# EAGLE design button configuration (EAGLE 9.3.0)
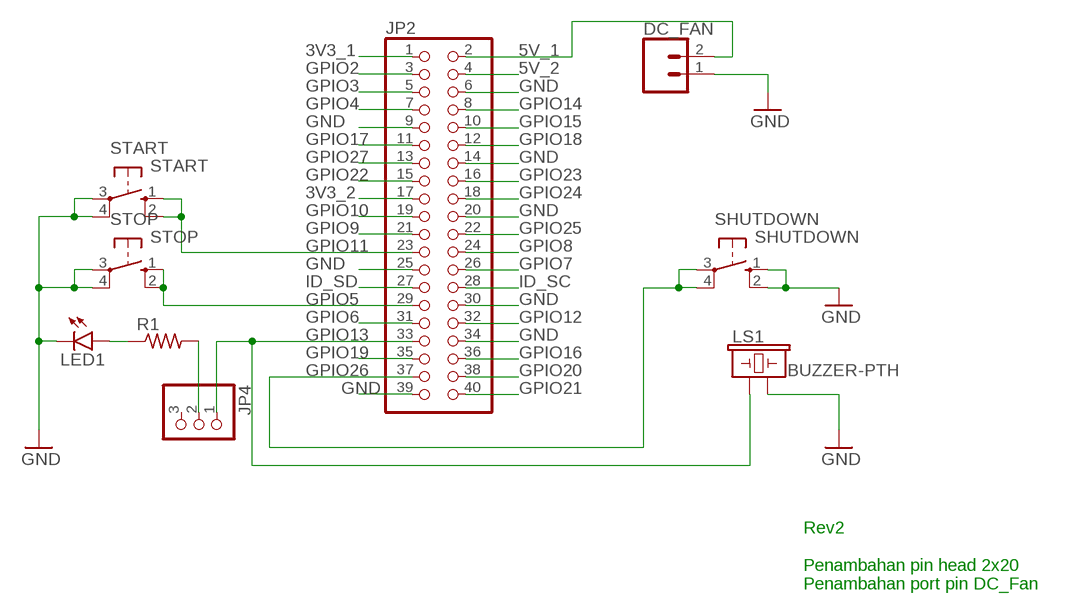
[diagram p0: schematic, sheet 1]

## Parts
DC_FAN  CONN_02  [1X02]
JP2  PINHD-2X20-BIG  [2X20-BIG]
JP4  PINHD-1X3  [1X03]
LED1  LED5MM  [LED5MM]
LS1  BUZZER-PTH  [BUZZER-12MM]
R1  R-US_0207/10  [0207/10]
SHUTDOWN  SHUTDOWN  40-XX  [B3F-40XX]
START  START  40-XX  [B3F-40XX]
STOP  STOP  40-XX  [B3F-40XX]

## Nets
3V3_1: JP2.1
3V3_2: JP2.17
5V_1: DC_FAN.2 JP2.2
5V_2: JP2.4
GND: DC_FAN.1 JP2.6 JP2.9 JP2.14 JP2.20 JP2.25 JP2.30 JP2.34 JP2.39 LED1.K(C) LS1.- SHUTDOWN.1(S) SHUTDOWN.2(S1) START.3(P) START.4(P1) STOP.3(P) STOP.4(P1)
GPIO2: JP2.3
GPIO3: JP2.5
GPIO4: JP2.7
GPIO5: JP2.29 STOP.1(S) STOP.2(S1)
GPIO6: JP2.31
GPIO7: JP2.26
GPIO8: JP2.24
GPIO9: JP2.21
GPIO10: JP2.19
GPIO11: JP2.23 START.1(S) START.2(S1)
GPIO12: JP2.32
GPIO13: JP2.33 JP4.1 LS1.+
GPIO14: JP2.8
GPIO15: JP2.10
GPIO16: JP2.36
GPIO17: JP2.11
GPIO18: JP2.12
GPIO19: JP2.35
GPIO20: JP2.38
GPIO21: JP2.40
GPIO22: JP2.15
GPIO23: JP2.16
GPIO24: JP2.18
GPIO25: JP2.22
GPIO26: JP2.37 SHUTDOWN.3(P) SHUTDOWN.4(P1)
GPIO27: JP2.13
ID_SC: JP2.28
ID_SD: JP2.27
N$1: LED1.A R1.1
N$3: JP4.2 R1.2
Unconnected: JP4.3

## Notes on the sheet
- Rev2
  
  Penambahan pin head 2x20
  Penambahan port pin DC_Fan

## Library data of the parts
DC_FAN = SparkFun-Connectors:CONN_02: Multi connection point. Often used as Generic Header-pin footprint for 0.1 inch spaced/style header connections On any of the 0.1 inch spaced packages, you can populate with these: Break Away Headers - Straight <https://www.sparkfun.com/products/116> (PRT-00116) Break Away Male Headers - Right Angle <https://www.sparkfun.com/products/553> (PRT-00553) Female Headers <https://www.sparkfun.com/products/115> (PRT-00115) Break Away Headers - Machine Pin <https://www.sparkfun.com/products/117> (PRT-00117) Break Away Female Headers - Swiss Machine Pin <https://www.sparkfun.com/products/743> (PRT-00743) For SCREWTERMINALS and SPRING TERMINALS visit here: Screw Terimnals on SparkFun.com <https://www.sparkfun.com/search/results?term=Screw+Terminals> (5mm/3.5mm/2.54mm spacing) This device is also useful as a general connection point to wire up your design to another part of your project. Our various solder wires solder well into these plated through hole pads. Hook-Up Wire - Assortment (Stranded, 22 AWG) <https://www.sparkfun.com/products/11375> (PRT-11375) Hook-Up Wire - Assortment (Solid Core, 22 AWG) <https://www.sparkfun.com/products/11367> (PRT-11367) View the entire wire category on our website here <https://www.sparkfun.com/categories/141> Special notes: Molex polarized connector foot print use with: PRT-08233 with associated crimp pins and housings. 2.54_SCREWTERM for use with PRT-10571. 3.5mm Screw Terminal footprints for PRT-08084 5mm Screw Terminal footprints for use with PRT-08432
JP2 = adafruit:PINHD-2X20: PIN HEADER
JP4 = adafruit:PINHD-1X3: PIN HEADER
LED1 = led:LED: LED OSRAM: - CHIPLED LG R971, LG N971, LY N971, LG Q971, LY Q971, LO R971, LY R971 LH N974, LH R974 LS Q976, LO Q976, LY Q976 LO Q996 - Hyper CHIPLED LW Q18S LB Q993, LB Q99A, LB R99A - SideLED LS A670, LO A670, LY A670, LG A670, LP A670 LB A673, LV A673, LT A673, LW A673 LH A674 LY A675 LS A676, LA A676, LO A676, LY A676, LW A676 LS A679, LY A679, LG A679 - Hyper Micro SIDELED® LS Y876, LA Y876, LO Y876, LY Y876 LT Y87S - SmartLED LW L88C, LW L88S LB L89C, LB L89S, LG L890 LS L89K, LO L89K, LY L89K LS L896, LA L896, LO L896, LY L896 - TOPLED LS T670, LO T670, LY T670, LG T670, LP T670 LSG T670, LSP T670, LSY T670, LOP T670, LYG T670 LG T671, LOG T671, LSG T671 LB T673, LV T673, LT T673, LW T673 LH T674 LS T676, LA T676, LO T676, LY T676, LB T676, LH T676, LSB T676, LW T676 LB T67C, LV T67C, LT T67C, LS T67K, LO T67K, LY T67K, LW E67C LS E67B, LA E67B, LO E67B, LY E67B, LB E67C, LV E67C, LT E67C LW T67C LS T679, LY T679, LG T679 LS T770, LO T770, LY T770, LG T770, LP T770 LB T773, LV T773, LT T773, LW T773 LH T774 LS E675, LA E675, LY E675, LS T675 LS T776, LA T776, LO T776, LY T776, LB T776 LHGB T686 LT T68C, LB T68C - Hyper Mini TOPLED® LB M676 - Mini TOPLED Santana® LG M470 LS M47K, LO M47K, LY M47K Source: http://www.osram.convergy.de LUXEON: - LUMILED® LXK2-PW12-R00, LXK2-PW12-S00, LXK2-PW14-U00, LXK2-PW14-V00 LXK2-PM12-R00, LXK2-PM12-S00, LXK2-PM14-U00 LXK2-PE12-Q00, LXK2-PE12-R00, LXK2-PE12-S00, LXK2-PE14-T00, LXK2-PE14-U00 LXK2-PB12-K00, LXK2-PB12-L00, LXK2-PB12-M00, LXK2-PB14-N00, LXK2-PB14-P00, LXK2-PB14-Q00 LXK2-PR12-L00, LXK2-PR12-M00, LXK2-PR14-Q00, LXK2-PR14-R00 LXK2-PD12-Q00, LXK2-PD12-R00, LXK2-PD12-S00 LXK2-PH12-R00, LXK2-PH12-S00 LXK2-PL12-P00, LXK2-PL12-Q00, LXK2-PL12-R00 Source: www.luxeon.com KINGBRIGHT: KA-3528ASYC Source: www.kingbright.com
LS1 = SparkFun-Electromechanical:BUZZER: Buzzer Small round buzzers that operate around the audible 2kHz range. You can use these as speakers to create simple music or user interfaces. Variant Overview: PTH - Mini Speaker - PC Mount 12mm 2.048kHz <https://www.sparkfun.com/products/7950> PTH_KIT - Mini Speaker - PC Mount 12mm 2.048kHz <https://www.sparkfun.com/products/7950> KIT simplifies soldering by adding stop mask to one side of the pads. PTH_NO_SILK - Mini Speaker - PC Mount 12mm 2.048kHz <https://www.sparkfun.com/products/7950> No silkscreen indicator of buzzer outline. PTH_KIT_NO_SILK - Mini Speaker - PC Mount 12mm 2.048kHz <https://www.sparkfun.com/products/7950> KIT package w/o silkscreen SMD - Buzzer Audio Magnetic (CCV-084B16) SMD buzzer used on, e.g. the LilyPad Buzzer <https://www.sparkfun.com/products/8463> and RFID USB Reader <https://www.sparkfun.com/products/9963>. SMD_KIT - Buzzer Audio Magnetic (CCV-084B16) SMD Buzzer with elongated pins to make soldering easier. Used on the SparkFun Simon Says - Surface Mount Soldering Kit <https://www.sparkfun.com/products/10935>.; PROD_ID: COMP-08253; SF_SKU: COM-07950
R1 = rcl:R-US_: RESISTOR, American symbol; SPICEPREFIX: R
SHUTDOWN START STOP = adafruit:40-XX: OMRON SWITCH; MF: OMRON COMPONENTS USA; MPN: B3F-4000; OC_FARNELL: 176434; OC_NEWARK: 36K3105

## Board
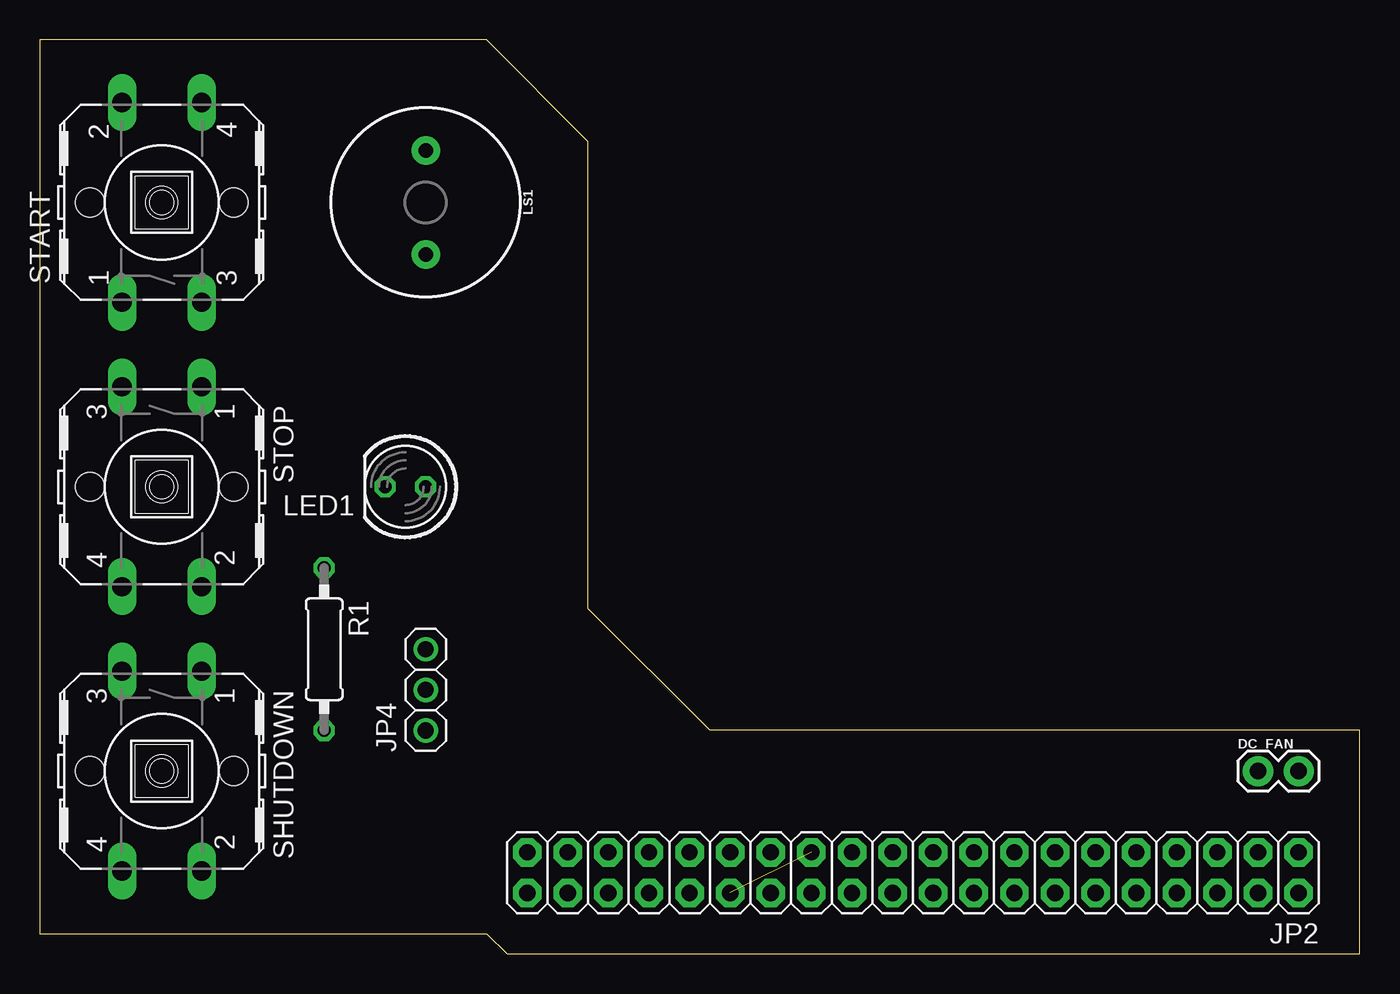
[diagram p1: board, top side]
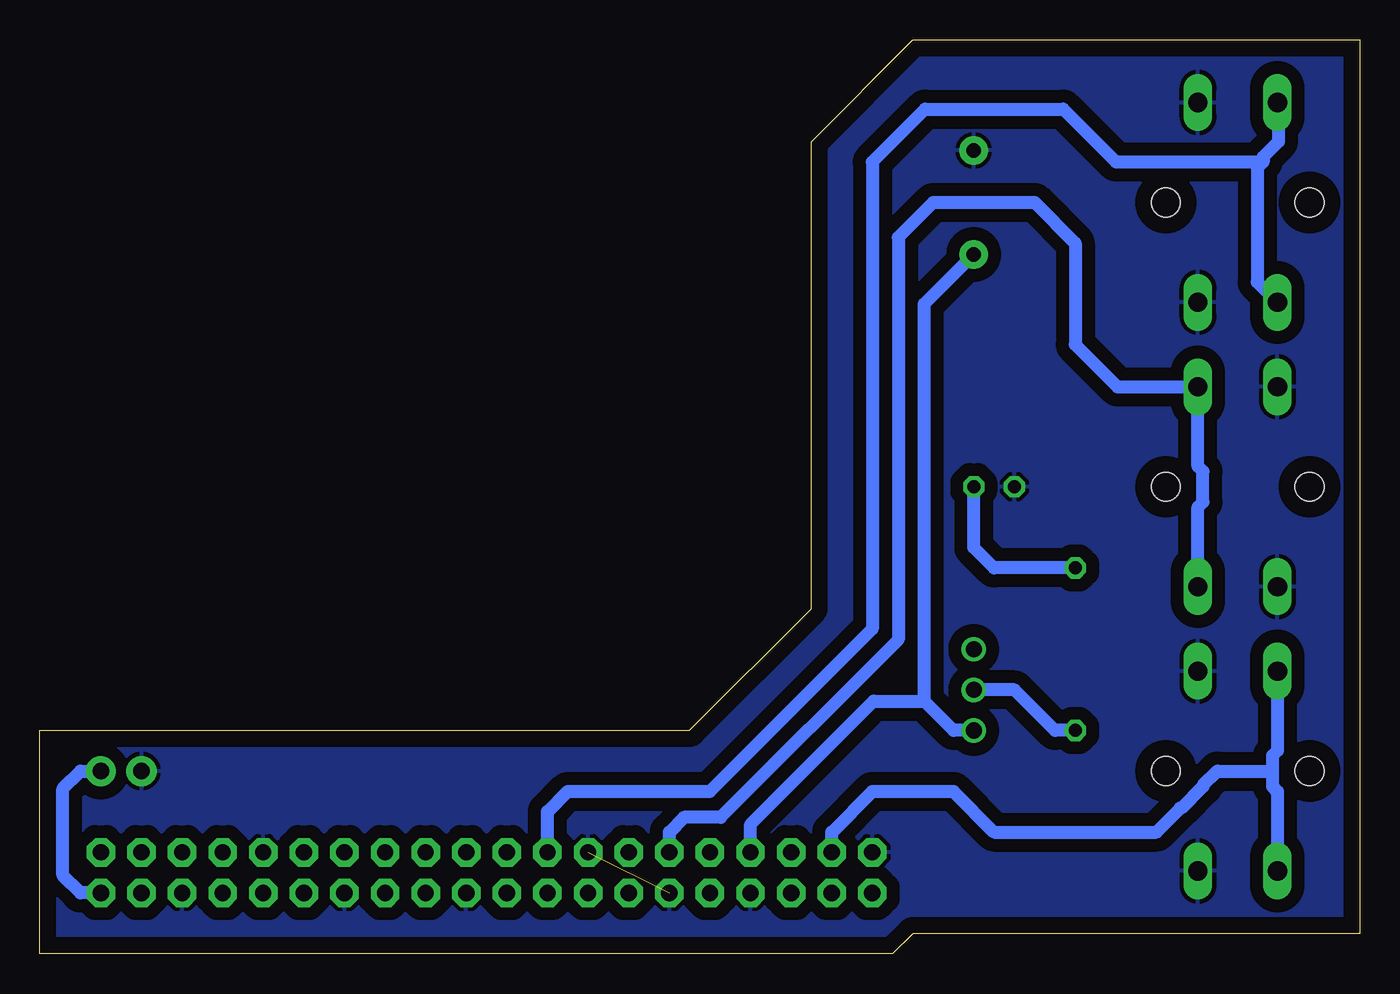
[diagram p2: board, bottom side, seen from below]

Size 82.55 x 57.15 mm. Coordinates in mm from the lower left corner, seen from the top.
Outline: 0,1.27 27.94,1.27 29.21,0 82.55,0 82.55,13.97 41.91,13.97 34.29,21.59 34.29,50.8 27.94,57.15 0,57.15 0,1.27
Copper layers (1*16): Top 0.035mm / dielectric 1.5mm / Bottom 0.035mm
Design rules "default *": minimum track width 6mil, minimum drill 0.35mm, track to track 32mil, track to pad 32mil, pad to pad 6mil, via to via 6mil, smd to smd 6mil, copper to edge 40mil, drill to drill 6mil, minimum pad ring 10mil, minimum via ring 8mil, stop-mask expansion 4mil, vias tented up to drill 0mil, thermal gap 10mil

### Footprints (pad centres in the part's own frame; a part is rotated, then mirrored left to right if it is on the bottom)
1X02 = drill 1.016 pad 1.88: 1 0,0; 2 2.54,0
2X20-BIG = drill 1.016 pad 1.778 octagon: 1 -24.13,-1.27; 2 -24.13,1.27; 3 -21.59,-1.27; 4 -21.59,1.27; 5 -19.05,-1.27; 6 -19.05,1.27; 7 -16.51,-1.27; 8 -16.51,1.27; 9 -13.97,-1.27; 10 -13.97,1.27; 11 -11.43,-1.27; 12 -11.43,1.27; 13 -8.89,-1.27; 14 -8.89,1.27; 15 -6.35,-1.27; 16 -6.35,1.27; 17 -3.81,-1.27; 18 -3.81,1.27; 19 -1.27,-1.27; 20 -1.27,1.27; 21 1.27,-1.27; 22 1.27,1.27; 23 3.81,-1.27; 24 3.81,1.27; 25 6.35,-1.27; 26 6.35,1.27; 27 8.89,-1.27; 28 8.89,1.27; 29 11.43,-1.27; 30 11.43,1.27; 31 13.97,-1.27; 32 13.97,1.27; 33 16.51,-1.27; 34 16.51,1.27; 35 19.05,-1.27; 36 19.05,1.27; 37 21.59,-1.27; 38 21.59,1.27; 39 24.13,-1.27; 40 24.13,1.27
1X03 = drill 1.016: 1 -2.54,0; 2 0,0; 3 2.54,0
LED5MM = drill 0.813 octagon: A -1.27,0; K 1.27,0
BUZZER-12MM = drill 0.9 pad 1.778: + 3.25,0; - -3.25,0
0207/10 = drill 0.813 octagon: 1 -5.08,0; 2 5.08,0
B3F-40XX = drill 1.194 long: 1 -6.248,2.489; 2 6.248,2.489; 3 -6.248,-2.489; 4 6.248,-2.489 | hole 1.803: 0,-4.496; 0,4.496

### Placement (x,y rotation side)
DC_FAN  76.2,11.43 0 top
JP2  54.61,5.08 180 top
JP4  24.13,16.51 90 top
LED1  22.86,29.21 180 top
LS1  24.13,46.99 270 top
R1  17.78,19.05 270 top
SHUTDOWN  7.62,11.43 270 top
START  7.62,46.99 90 top
STOP  7.62,29.21 270 top

### Tracks (layer width: path | path; a pad name or v marks a point on that pad's centre or on a via)
5V_1
  Bottom 0.813: JP2.2 80.01,3.81 81.12,4.92 81.12,10.32 80.01,11.43 DC_FAN.2
GND  (1 unrouted)
  pour Bottom: 0,1.27 27.94,1.27 29.21,0 82.55,0 82.55,13.97 41.91,13.97 34.29,21.59 34.29,50.8 27.94,57.15 0,57.15
GPIO5
  Bottom 0.813: STOP.2 10.11,27.93 9.79,28.25 9.79,30.17 10.11,30.49 STOP.1 15.14,35.46 17.78,38.1 17.78,44.45 20.32,46.99 26.67,46.99 28.85,44.81 28.85,19.65 39.97,8.53 42.27,8.53 43.18,7.62 JP2.29
GPIO11
  Bottom 0.813: 6.03,49.53 15.24,49.53 18.54,52.83 27.18,52.83 30.48,49.53 30.48,20.32 40.64,10.16 49.53,10.16 50.8,8.89 JP2.23 | START.2 5.08,53.19 5.08,50.8 6.03,49.85 6.03,49.53 | START.1 6.4,42.01 6.4,49.16 6.03,49.53
GPIO13
  Bottom 0.813: LS1.+ 27.23,40.64 27.23,15.8 | JP4.1 25.4,13.97 27.23,15.8 | 27.23,15.8 30.4,15.8 38.1,8.1 JP2.33
GPIO26
  Bottom 0.813: SHUTDOWN.3 5.13,12.71 5.45,12.39 5.45,11.43 | 5.45,11.43 5.45,10.47 5.13,10.15 SHUTDOWN.4 | 5.45,11.43 8.89,11.43 9.79,10.53 9.79,10.47 11.15,9.11 11.21,9.11 12.7,7.62 22.86,7.62 25.4,10.16 30.48,10.16 33.02,7.62 JP2.37
N$1
  Bottom 0.813: R1.1 22.86,24.13 24.13,25.4 LED1.A
N$3
  Bottom 0.813: R1.2 19.05,13.97 21.59,16.51 JP4.2